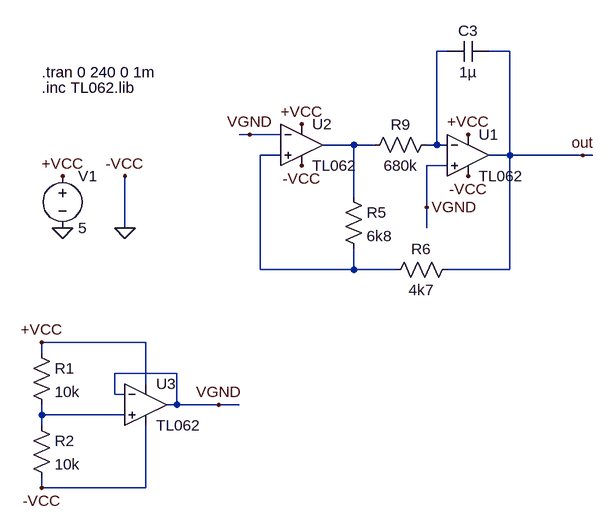
[diagram p0: schematic croissant_osc.asc]
croissant_osc.asc, the LTspice schematic file:
Version 4
SHEET 1 2292 712
WIRE 1024 -304 1008 -304
WIRE 1120 -304 1088 -304
WIRE 720 -176 704 -176
WIRE 768 -176 720 -176
WIRE 880 -160 832 -160
WIRE 912 -160 880 -160
WIRE 1008 -160 1008 -304
WIRE 1008 -160 992 -160
WIRE 1024 -160 1008 -160
WIRE 768 -144 736 -144
WIRE 1120 -144 1120 -304
WIRE 1120 -144 1088 -144
WIRE 1232 -144 1120 -144
WIRE 1248 -144 1232 -144
WIRE 1024 -128 992 -128
WIRE 880 -80 880 -160
WIRE 992 -64 992 -128
WIRE 528 -32 528 -112
WIRE 992 -32 992 -64
WIRE 736 32 736 -144
WIRE 880 32 880 0
WIRE 880 32 736 32
WIRE 944 32 880 32
WIRE 1120 32 1120 -144
WIRE 1120 32 1024 32
WIRE 560 144 400 144
WIRE 400 160 400 144
WIRE 608 192 512 192
WIRE 560 208 560 144
WIRE 512 224 512 192
WIRE 528 224 512 224
WIRE 608 240 608 192
WIRE 608 240 592 240
WIRE 672 240 608 240
WIRE 704 240 672 240
WIRE 400 256 400 240
WIRE 528 256 400 256
WIRE 400 272 400 256
WIRE 400 368 400 352
WIRE 560 368 560 272
WIRE 560 368 400 368
FLAG 432 -32 0
FLAG 528 -32 0
FLAG 432 -112 +VCC
FLAG 528 -112 -VCC
FLAG 800 -192 +VCC
FLAG 1056 -176 +VCC
FLAG 800 -128 -VCC
FLAG 1056 -112 -VCC
FLAG 1232 -144 out
FLAG 400 144 +VCC
FLAG 400 368 -VCC
FLAG 672 240 VGND
FLAG 720 -176 VGND
FLAG 992 -64 VGND
SYMBOL External\\voltage 432 -128 R0
WINDOW 123 0 0 Left 0
WINDOW 39 0 0 Left 0
SYMATTR InstName V1
SYMATTR Value 5
SYMBOL res 864 -96 R0
SYMATTR InstName R5
SYMATTR Value 6k8
SYMBOL res 1040 16 R90
WINDOW 0 0 56 VBottom 2
WINDOW 3 32 56 VTop 2
SYMATTR InstName R6
SYMATTR Value 4k7
SYMBOL res 1008 -176 R90
WINDOW 0 0 56 VBottom 2
WINDOW 3 32 56 VTop 2
SYMATTR InstName R9
SYMATTR Value 680k
SYMBOL cap 1088 -320 R90
WINDOW 0 0 32 VBottom 2
WINDOW 3 32 32 VTop 2
SYMATTR InstName C3
SYMATTR Value 1µ
SYMBOL res 384 144 R0
SYMATTR InstName R1
SYMATTR Value 10k
SYMBOL res 384 256 R0
SYMATTR InstName R2
SYMATTR Value 10k
SYMBOL Arturia\\TL062 1056 -144 R0
SYMATTR InstName U1
SYMATTR Value TL062
SYMBOL Arturia\\TL062 800 -160 R0
SYMATTR InstName U2
SYMATTR Value TL062
SYMBOL Arturia\\TL062 560 240 R0
SYMATTR InstName U3
SYMATTR Value TL062
TEXT 400 -272 Left 2 !.tran 0 240 0 1m
TEXT 400 -248 Left 2 !.inc TL062.lib

The netlist it stands for:
* croissant_osc.asc
V1 +VCC 0 5
R5 N002 N003 6k8
R6 out N003 4k7
R9 N001 N002 680k
C3 out N001 1µ
R1 +VCC N004 10k
R2 N004 0 10k
* U1: TL062 (symbol Arturia\TL062 not available, pins judged from their places): In+=VGND In-=N001 V+=+VCC V-=0 OUT=out
* U2: TL062 (symbol Arturia\TL062 not available, pins judged from their places): In+=N003 In-=VGND V+=+VCC V-=0 OUT=N002
* U3: TL062 (symbol Arturia\TL062 not available, pins judged from their places): In+=N004 In-=VGND V+=+VCC V-=0 OUT=VGND
.tran 0 240 0 1m
.inc TL062.lib
.backanno
.end